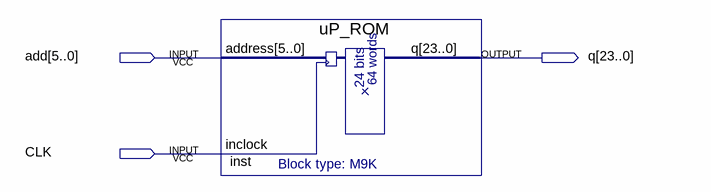
[diagram p0: schematic sheet]
// Quartus schematic uP_ROM_test.bdf as structural Verilog: 1 symbols, 3 pins
module uP_ROM_test (
  input  [5:0] add,
  input  CLK,
  output [23:0] q
);

  uP_ROM inst (.address(add), .inclock(CLK), .q(q));
endmodule
